# Altium schematic sheet Ethernet.SchDoc
size A4; SheetNumber: 2; SheetTotal: 2
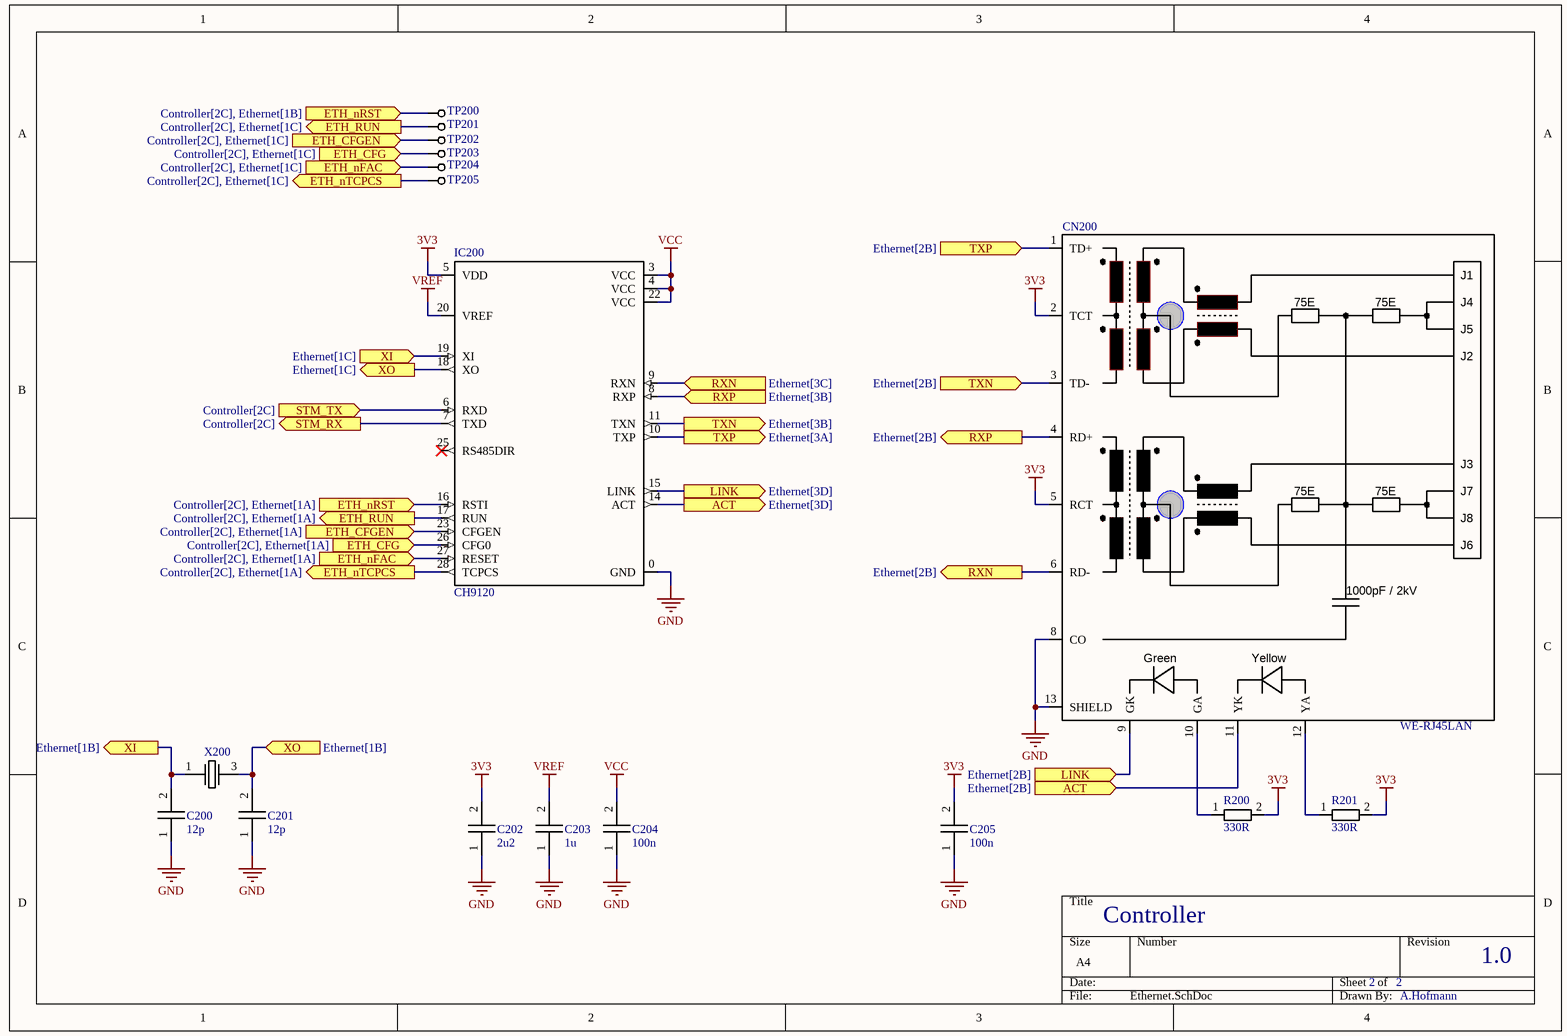
[diagram p0: Ethernet.SchDoc]

## Parts
C200  12p  [C_0402]
C201  12p  [C_0402]
C202  2u2  [C_0603]
C203  1u  [C_0603]
C204  100n  [C_0402]
C205  100n  [C_0402]
CN200  WE-RJ45LAN  [7499010121A]
IC200  CH9120  [QFN28]
R200  330R  [R_0402]
R201  330R  [R_0402]
TP200  TP  [STP_0.5mm]  (value not drawn)
TP201  TP  [STP_0.5mm]  (value not drawn)
TP202  TP  [STP_0.5mm]  (value not drawn)
TP203  TP  [STP_0.5mm]  (value not drawn)
TP204  TP  [STP_0.5mm]  (value not drawn)
TP205  TP  [STP_0.5mm]  (value not drawn)
X200  XRCGB32M000F0L00R0  [HCR2016]  (value not drawn)

## Ports
ACT (in, see Ethernet[2B]), ACT (out, see Ethernet[3D]), ETH_CFG (in, see Controller[2C], Ethernet[1A]), ETH_CFG (in, see Controller[2C], Ethernet[1C]), ETH_CFGEN (in, see Controller[2C], Ethernet[1A]), ETH_CFGEN (in, see Controller[2C], Ethernet[1C]), ETH_nFAC (in, see Controller[2C], Ethernet[1A]), ETH_nFAC (in, see Controller[2C], Ethernet[1C]), ETH_nRST (in, see Controller[2C], Ethernet[1A]), ETH_nRST (in, see Controller[2C], Ethernet[1B]), ETH_nTCPCS (out, see Controller[2C], Ethernet[1A]), ETH_nTCPCS (out, see Controller[2C], Ethernet[1C]), ETH_RUN (out, see Controller[2C], Ethernet[1A]), ETH_RUN (out, see Controller[2C], Ethernet[1C]), LINK (in, see Ethernet[2B]), LINK (out, see Ethernet[3D]), RXN (in, see Ethernet[3C]), RXN (out, see Ethernet[2B]), RXP (in, see Ethernet[3B]), RXP (out, see Ethernet[2B]), STM_RX (out, see Controller[2C]), STM_TX (in, see Controller[2C]), TXN (in, see Ethernet[2B]), TXN (out, see Ethernet[3B]), TXP (in, see Ethernet[2B]), TXP (out, see Ethernet[3A]), XI (in, see Ethernet[1C]), XI (out, see Ethernet[1B]), XO (in, see Ethernet[1B]), XO (out, see Ethernet[1C])

## Nets
3V3: C202.2 C205.2 CN200.2(TCT) CN200.5(RCT) IC200.5(VDD) R200.2 R201.2
GND: C200.1 C201.1 C202.1 C203.1 C204.1 C205.1 CN200.8(CO) CN200.13(SHIELD) IC200.0(GND)
VCC: C204.2 IC200.3(VCC) IC200.4(VCC) IC200.22(VCC)
VREF: C203.2 IC200.20(VREF)
ACT: CN200.11(YK) IC200.14(ACT) ; port ACT
ETH_CFG: IC200.26(CFG0) TP203.1 ; port ETH_CFG
ETH_CFGEN: IC200.23(CFGEN) TP202.1 ; port ETH_CFGEN
ETH_nFAC: IC200.27(RESET) TP204.1 ; port ETH_nFAC
ETH_nRST: IC200.16(RSTI) TP200.1 ; port ETH_nRST
ETH_nTCPCS: IC200.28(TCPCS) TP205.1 ; port ETH_nTCPCS
ETH_RUN: IC200.17(RUN) TP201.1 ; port ETH_RUN
LINK: CN200.9(GK) IC200.15(LINK) ; port LINK
RXN: CN200.6(RD-) IC200.9(RXN) ; port RXN
RXP: CN200.4(RD+) IC200.8(RXP) ; port RXP
STM_RX: IC200.7(TXD) ; port STM_RX
STM_TX: IC200.6(RXD) ; port STM_TX
TXN: CN200.3(TD-) IC200.11(TXN) ; port TXN
TXP: CN200.1(TD+) IC200.10(TXP) ; port TXP
XI: C200.2 IC200.19(XI) X200.1 ; port XI
XO: C201.2 IC200.18(XO) X200.3 ; port XO
NetCN200_10: CN200.10(GA) R200.1
NetCN200_12: CN200.12(YA) R201.1

Not connected (* = marked no-connect by the designer): IC200 25(RS485DIR)*

## Notes on the sheet
- Controller
- 2
- 1.0
- A.Hofmann
- (in symbol WE-RJ45LAN) J1; 75E; J4; J5; J2; J3; J7; J8; J6; 1000pF / 2kV; Green; Yellow

## Library data of the parts
C200-C205 = CeCa
CN200 = WE-RJ45LAN: Modulare Steckverbinder / Ethernet-Steckverbinder WE-RJ45 Intgtd XFMR 1x1 THT Tab Up; ComponentLink1Description: Datasheet; ComponentLink1URL: https://www.we-online.com/components/products/datasheet/7499010121A.pdf
IC200 = CH9120: Network and UART Transparent Transmission Chip; ComponentLink1Description: Datasheet; ComponentLink1URL: http://www.wch-ic.com/downloads/file/317.html?time=2022-08-22%2013:41:33&code=5fVJkrWqOqsN9oFySIYUkoTgQwx098RKZyXylZKH
R200 R201 = Res
X200 = XRCGB32M000F0L00R0: ComponentLink1Description: New link; ComponentLink1URL: https://www.murata.com/products/productdata/8801079099422/SPEC-XRCGB32M000F0L00R0.pdf?1541043011000